# EAGLE schematic untitled (EAGLE 9.6.2)
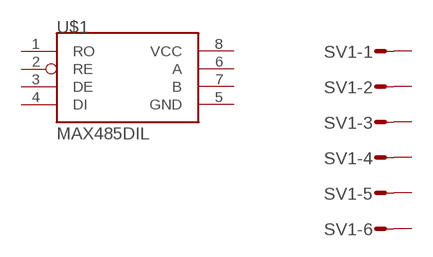
[diagram p0: schematic, sheet 1]

## Parts
SV1  MT6-6  [MT6-6]
U$1  MAX485DIL  [DIL08]
Unconnected: SV1.1 SV1.2 SV1.3 SV1.4 SV1.5 SV1.6 U$1.1(RO) U$1.2(RE) U$1.3(DE) U$1.4(DI) U$1.5(GND) U$1.6(A) U$1.7(B) U$1.8(VCC)

## Library data of the parts
SV1 = con-amp-mt:MT6-6: AMP MT6 CONNECTOR; OC_FARNELL: unknown; OC_NEWARK: unknown
U$1 = MAXIM:MAX485